# EAGLE design PickupBoard (EAGLE 7.2.0)
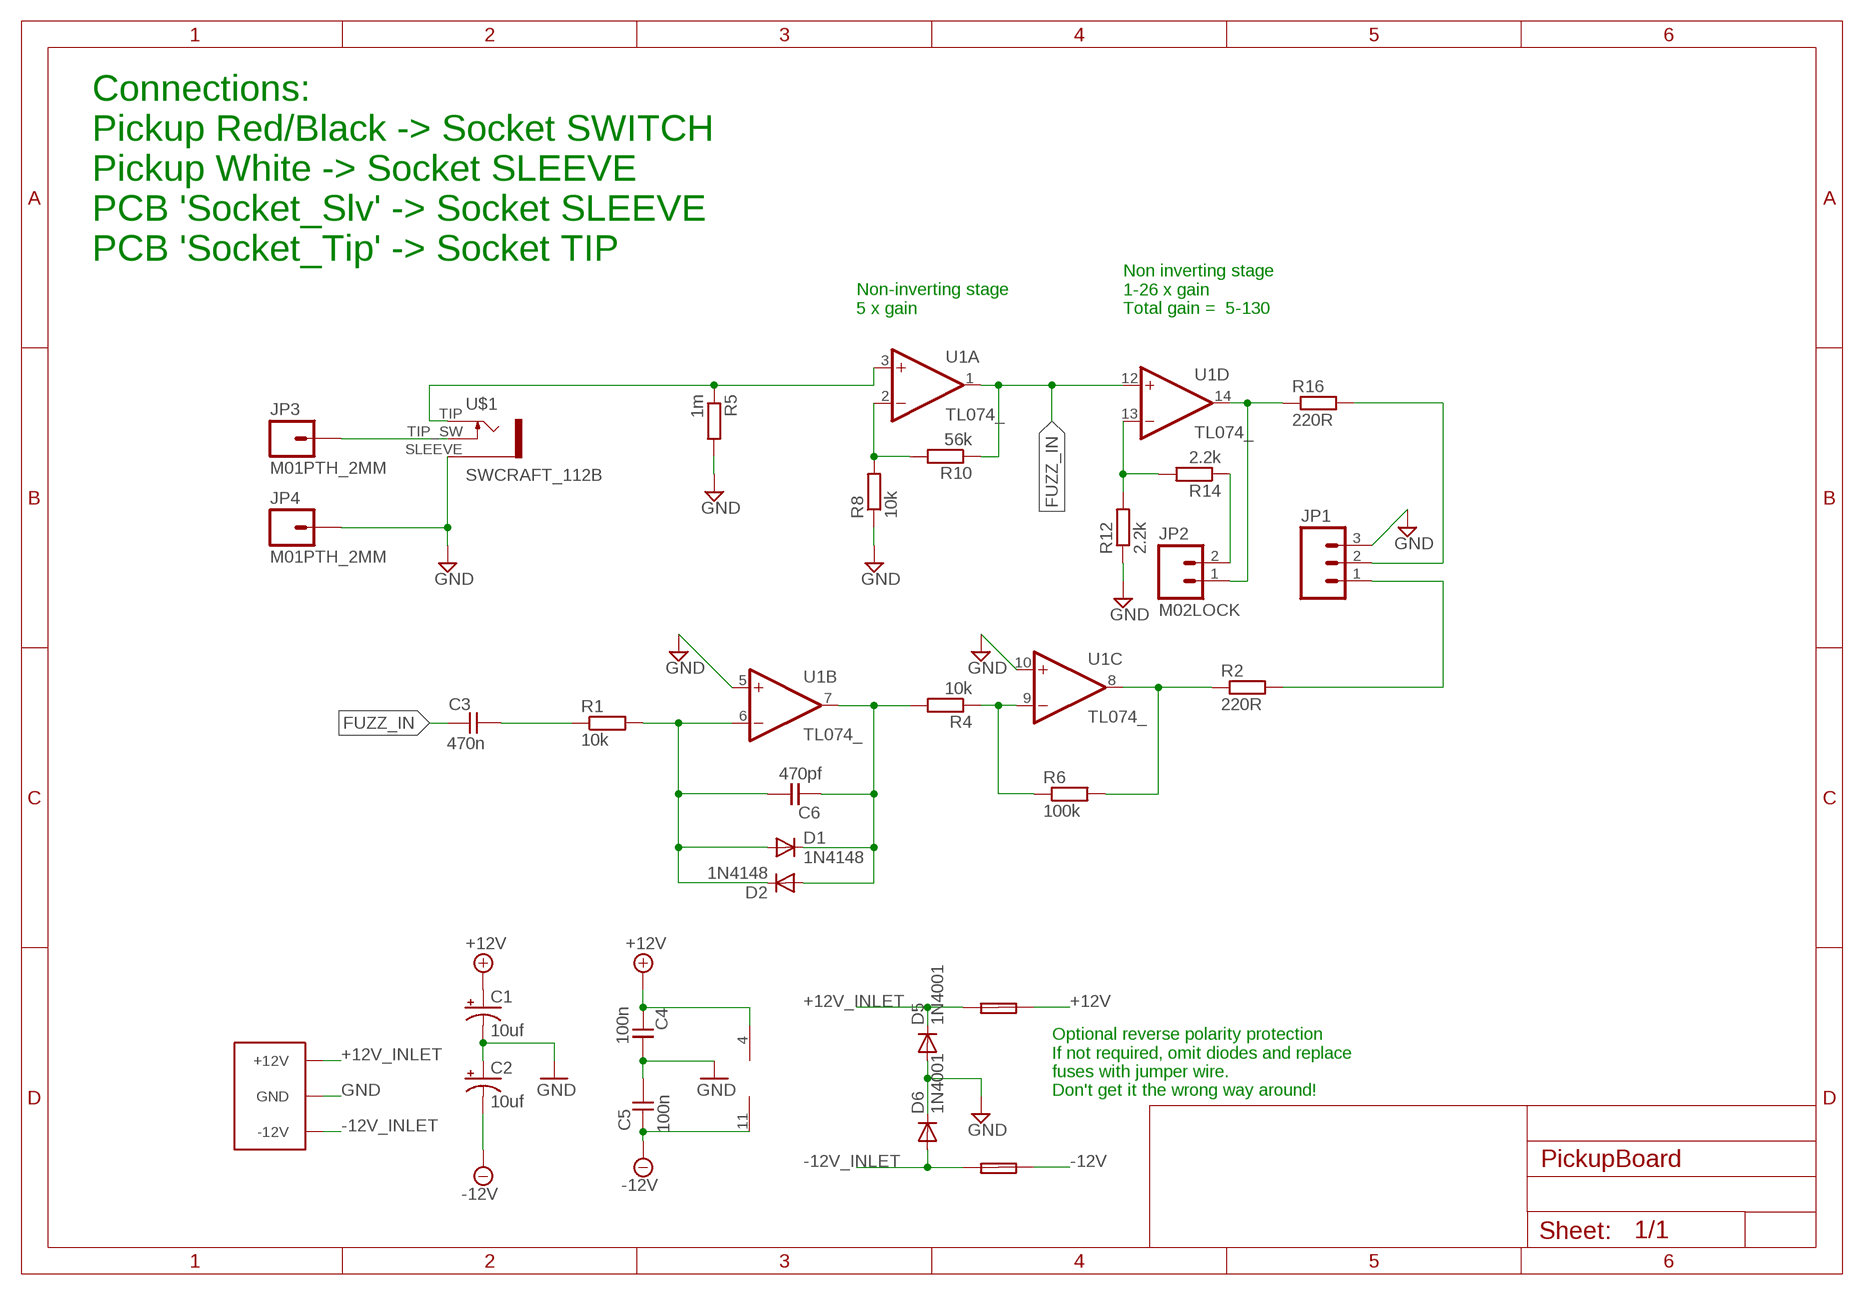
[diagram p0: schematic, sheet 1]

## Parts
1  FUSE  PTC_FUSEPOLY_FUSE  [C050H075X075]
C1  10uf  CAP_POLPTH2  [CPOL-RADIAL-10UF-25V]
C2  10uf  CAP_POLPTH2  [CPOL-RADIAL-10UF-25V]
C3  470n  C-EU050-024X044  [C050-024X044]
C4  100n  C-EU050-024X044  [C050-024X044]
C5  100n  C-EU050-024X044  [C050-024X044]
C6  470pf  C-EU050-024X044  [C050-024X044]
D1  1N4148  SMALL_DIODEDO35-7  [DO35-7]
D2  1N4148  SMALL_DIODEDO35-7  [DO35-7]
D5  1N4001  1N4004  [DO41-10]
D6  1N4001  1N4004  [DO41-10]
FUSE  FUSE  PTC_FUSEPOLY_FUSE  [C050H075X075]
JP1  M03LOCK  [1X03_LOCK]
JP2  M02LOCK  [1X02_LOCK]
JP3  M01PTH_2MM  [1X01_2MM]
JP4  M01PTH_2MM  [1X01_2MM]
R1  10k  RESISTOR7MM  [7MM_RESISTOR]
R2  220R  RESISTOR7MM  [7MM_RESISTOR]
R4  10k  RESISTOR7MM  [7MM_RESISTOR]
R5  1m  RESISTOR7MM  [7MM_RESISTOR]
R6  100k  RESISTOR7MM  [7MM_RESISTOR]
R8  10k  RESISTOR7MM  [7MM_RESISTOR]
R10  56k  RESISTOR7MM  [7MM_RESISTOR]
R12  2.2k  RESISTOR7MM  [7MM_RESISTOR]
R14  2.2k  RESISTOR7MM  [7MM_RESISTOR]
R16  220R  RESISTOR7MM  [7MM_RESISTOR]
U1  TL074_  [DIL14]
U$1  SWCRAFT_112B  [SWCRAFT_112_SLOTS]
U$2  EURO_POWER_LOCK  [EURO_PWR_HEADER_LOCK]

## Nets
+12V [power]: 1.2 C1.1(+) C4.2 U1.4(P:V+)
+12V_INLET: 1.1 D5.C U$2.POS1(+12V) U$2.POS2(+12V)
-12V [power]: C2.2(-) C5.2 FUSE.2 U1.11(P:V-)
-12V_INLET: D6.A FUSE.1 U$2.NEG1(-12V) U$2.NEG2(-12V)
FUZZ_IN: C3.2 R10.1 U1.1(A:OUT) U1.12(D:+IN)
GND [ground]: C1.2(-) C2.1(+) C4.1 C5.1 D5.A D6.C JP1.3 JP4.1 R5.2 R8.1 R12.1 U1.5(B:+IN) U1.10(C:+IN) U$1.SLEEVE U$2.GND1(GND) U$2.GND2(GND) U$2.GND3(GND) U$2.GND4(GND) U$2.GND5(GND) U$2.GND6(GND)
N$1: R5.1 U1.3(A:+IN) U$1.TIP
N$2: C6.2 D1.C D2.A R4.2 U1.7(B:OUT)
N$3: R8.2 R10.2 U1.2(A:-IN)
N$4: C6.1 D1.A D2.C R1.2 U1.6(B:-IN)
N$5: JP2.2 R14.1
N$6: R12.2 R14.2 U1.13(D:-IN)
N$7: C3.1 R1.1
N$8: JP2.1 R16.1 U1.14(D:OUT)
N$9: R4.1 R6.1 U1.9(C:-IN)
N$10: JP1.2 R16.2
N$11: R2.1 R6.2 U1.8(C:OUT)
N$13: JP1.1 R2.2
N$14: JP3.1 U$1.TIP_SW

## Notes on the sheet
- Connections:
  Pickup Red/Black -> Socket SWITCH
  Pickup White -> Socket SLEEVE
  PCB 'Socket_Slv' -> Socket SLEEVE
  PCB 'Socket_Tip' -> Socket TIP
- Non-inverting stage
  5 x gain
- Non inverting stage
  1-26 x gain
  Total gain =  5-130
- Optional reverse polarity protection
  If not required, omit diodes and replace
  fuses with jumper wire. 
  Don't get it the wrong way around!

## Library data of the parts
1 FUSE = TomW:PTC_FUSE
C1 C2 = SparkFun-Passives:CAP_POL: Capacitor Polarized These are standard SMD and PTH capacitors. Normally 10uF, 47uF, and 100uF in electrolytic and tantalum varieties. Always verify the external diameter of the through hole cap, it varies with capacity, voltage, and manufacturer. The EIA devices should be standard.
C3-C6 = TomW:C-EU: CAPACITOR, European symbol
D1 D2 = MusicThingModular:SMALL_DIODE: Small Signal Diode
D5 D6 = diode:1N4004: DIODE general purpose rectifier, 1 A
JP1 = SparkFun-Connectors:M03: Header 3 Standard 3-pin 0.1" header. Use with straight break away headers (SKU : PRT-00116), right angle break away headers (PRT-00553), swiss pins (PRT-00743), machine pins (PRT-00117), and female headers (PRT-00115). Molex polarized connector foot print use with SKU : PRT-08232 with associated crimp pins and housings.
JP2 = SparkFun-Connectors:M02: Standard 2-pin 0.1" header. Use with - straight break away headers ( PRT-00116) - right angle break away headers (PRT-00553) - swiss pins (PRT-00743) - machine pins (PRT-00117) - female headers (PRT-00115) Molex polarized connector foot print use with: PRT-08233 with associated crimp pins and housings. 2.54_SCREWTERM for use with PRT-10571. 3.5mm Screw Terminal footprints for PRT-08084 5mm Screw Terminal footprints for use with PRT-08433
JP3 JP4 = SparkFun-Connectors:M01: Header 1 Standard 1-pin 0.1" header. Use with straight break away headers (SKU : PRT-00116), right angle break away headers (PRT-00553), swiss pins (PRT-00743), machine pins (PRT-00117), and female headers (PRT-00115).
R1 R2 R4-R6 R8 R10 R12 R14 R16 = MusicThingModular:RESISTOR: Standard resistor, various versions
U1 = MusicThingModular:TL074: Generic Quad Op Amp
U$1 = TomW:SWCRAFT_112B
U$2 = MusicThingModular:EURO_POWER_LOCK

## Net classes
0 default: width 0.203 mm
1 power: width 0.203 mm
2 ground: width 0.203 mm

## Board
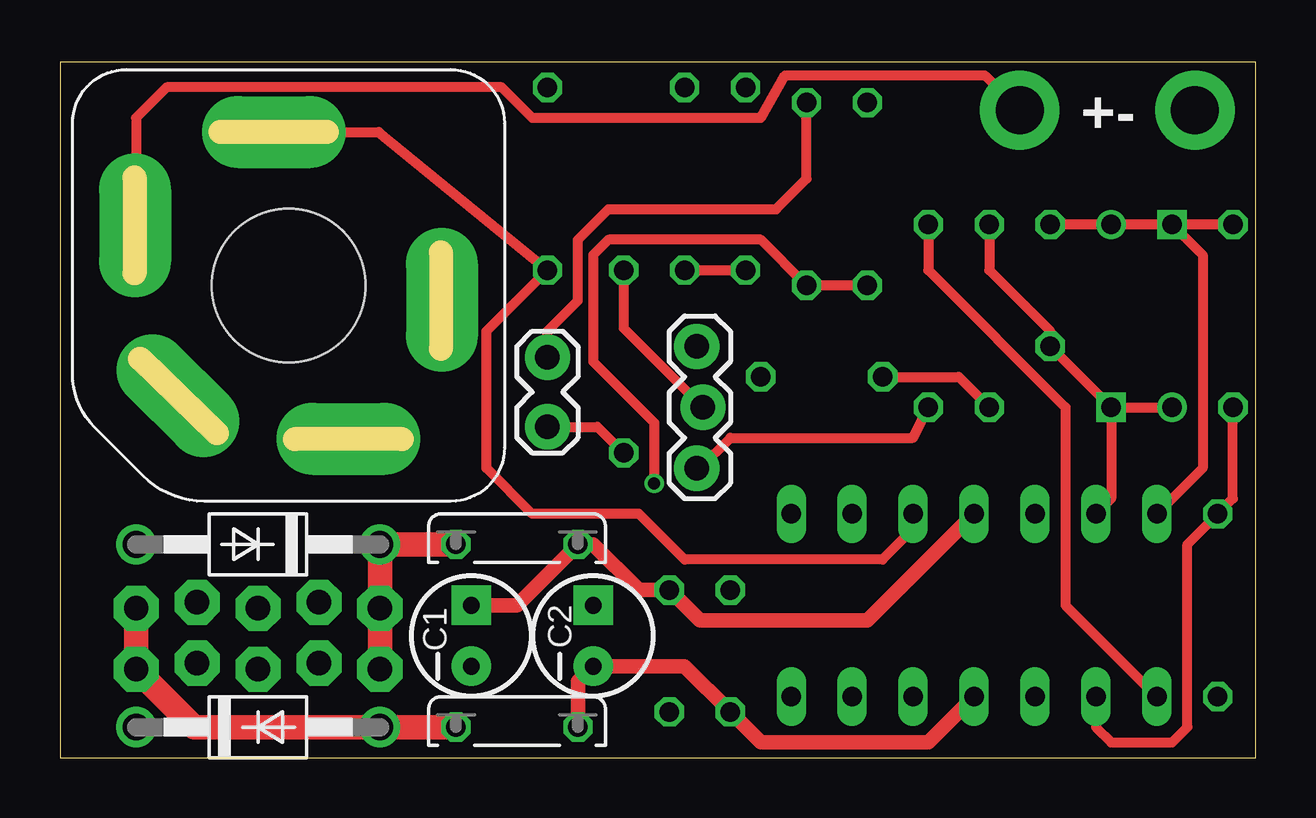
[diagram p1: board, top side]
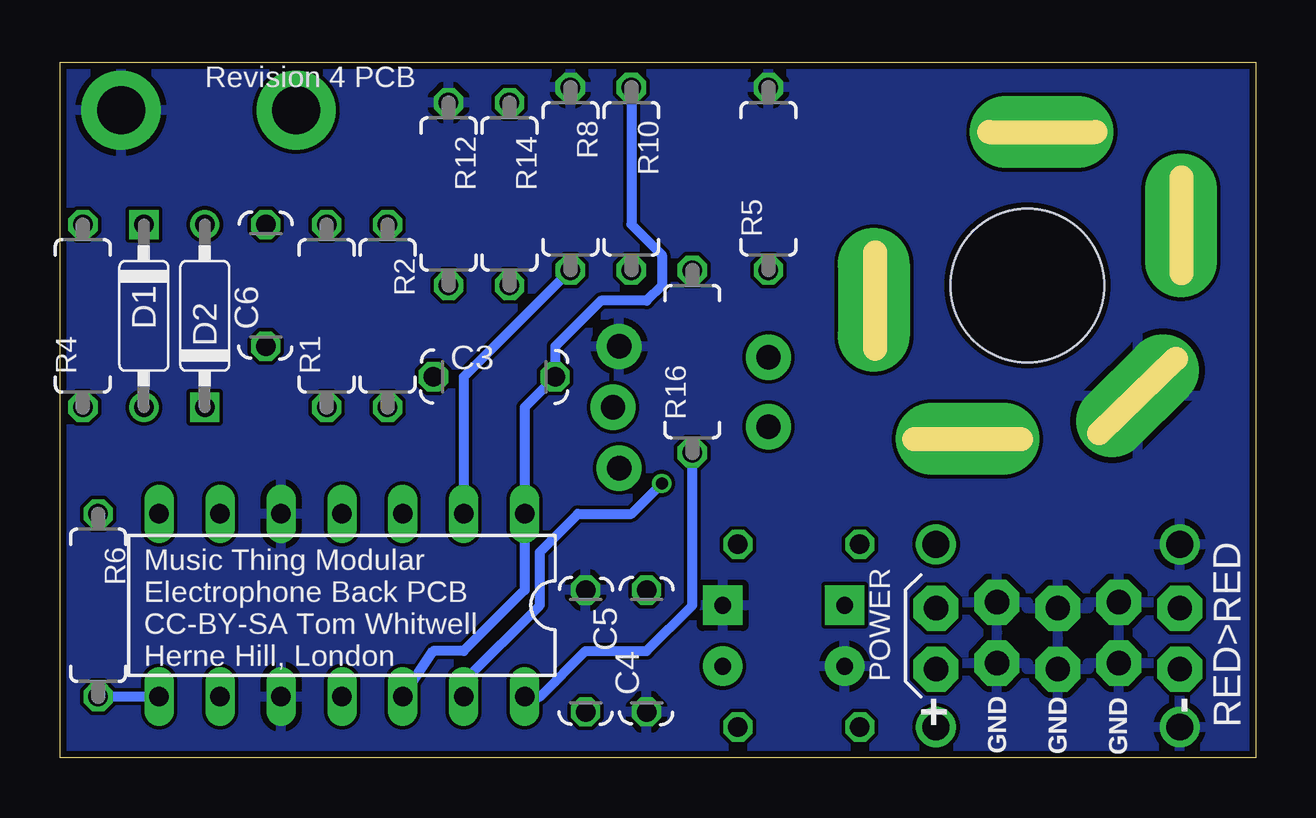
[diagram p2: board, bottom side, seen from below]

Size 49.85 x 29 mm. Coordinates in mm from the lower left corner, seen from the top.
Outline: 0,0 49.85,0 49.85,29 0,29 0,0
Copper layers (1*2*15*16): Top 0.035mm / dielectric 0.2mm / Route2 0.0175mm / dielectric 1.1mm / Route15 0.0175mm / dielectric 0.2mm / Bottom 0.035mm
Design rules "SeeedStudio_DRU_no_angle_20130527": minimum track width 6mil, minimum drill 12mil, track to track 6mil, track to pad 6mil, pad to pad 6mil, via to via 6mil, smd to smd 0mil, copper to edge 10mil, drill to drill 10mil, minimum pad ring 6mil, minimum via ring 6mil, stop-mask expansion 2mil, vias tented up to drill 25mil, thermal gap 10mil

### Footprints (pad centres in the part's own frame; a part is rotated, then mirrored left to right if it is on the bottom)
C050H075X075 = drill 0.813 octagon: 1 -2.54,0; 2 2.54,0
CPOL-RADIAL-10UF-25V = drill 0.7 pad 1.651 square: 1 1.27,0 | drill 0.7 pad 1.651: 2 -1.27,0
C050-024X044 = drill 0.813 octagon: 1 -2.54,0; 2 2.54,0
DO35-7 = drill 0.813: A 3.81,0 | drill 0.813 square: C -3.81,0
DO41-10 = drill 1.118: A 5.08,0; C -5.08,0
1X03_LOCK = drill 1.016 pad 1.88: 1 0,0.127; 2 2.54,-0.127; 3 5.08,0.127
1X02_LOCK = drill 1.016 pad 1.88: 1 -0.178,0; 2 2.718,0
1X01_2MM = drill 2 pad 3.302: 1 0,0
7MM_RESISTOR = drill 0.813 octagon: 1 -3.81,0; 2 3.81,0
DIL14 = drill 0.813 long: 1 -7.62,-3.81; 2 -5.08,-3.81; 3 -2.54,-3.81; 4 0,-3.81; 5 2.54,-3.81; 6 5.08,-3.81; 7 7.62,-3.81; 8 7.62,3.81; 9 5.08,3.81; 10 2.54,3.81; 11 0,3.81; 12 -2.54,3.81; 13 -5.08,3.81; 14 -7.62,3.81
SWCRAFT_112_SLOTS = drill 0.45 pad 3 long: RING 0.6,6.4; RING_SW 6.4,2.5; SLEEVE 4.6,-4.6; TIP -6.4,-0.6; TIP_SW -2.5,-6.4 | hole 6.4: 0,0
EURO_PWR_HEADER_LOCK = drill 1.016 pad 1.88 octagon: GND1 -2.54,1.143; GND2 -2.54,-1.397; GND3 0,1.397; GND4 0,-1.143; GND5 2.54,1.143; GND6 2.54,-1.397; NEG1 -5.08,1.397; NEG2 -5.08,-1.143; POS1 5.08,1.397; POS2 5.08,-1.143

### Placement (x,y rotation side)
1  19.05,8.89 0 top
C1  17.14,5.08 90 top
C2  22.23,5.08 90 top
C3  31.75,15.88 0 bottom
C4  25.4,4.45 90 bottom
C5  27.94,4.45 270 bottom
C6  41.27,19.68 90 bottom
D1  46.35,18.41 270 bottom
D2  43.81,18.41 90 bottom
D5  8.26,8.89 180 top
D6  8.26,1.27 0 top
FUSE  19.05,1.27 0 top
JP1  26.67,12.06 90 top
JP2  20.32,13.97 90 top
JP3  40.01,26.99 0 bottom
JP4  47.31,26.99 0 bottom
R1  38.73,18.41 90 bottom
R2  36.2,18.41 270 bottom
R4  48.9,18.41 90 bottom
R5  20.32,24.13 90 bottom
R6  48.26,6.35 270 bottom
R8  28.57,24.13 270 bottom
R10  26.04,24.13 270 bottom
R12  33.66,23.5 270 bottom
R14  31.11,23.5 270 bottom
R16  23.5,16.51 90 bottom
U1  38.1,6.35 180 bottom
U$1  9.53,19.68 270 top
U$2  8.26,5.08 180 bottom

### Tracks (layer width: path | path; a pad name or v marks a point on that pad's centre or on a via)
+12V
  Top 0.61: C1.1 19.05,6.35 1.2 22.23,8.89 24.13,6.99 C4.2 26.67,5.71 33.66,5.71 U1.4
+12V_INLET
  Top 1.016: U$2.POS1 U$2.POS2 D5.C 1.1
-12V
  Top 0.61: FUSE.2 21.59,3.17 C2.2 26.04,3.81 C5.2 29.21,0.64 31.11,0.64 36.2,0.64 U1.11
-12V_INLET
  Top 1.016: FUSE.1 D6.A 5.59,1.27 U$2.NEG1 U$2.NEG2
FUZZ_IN
  Bottom 0.406: U1.12 34.29,4.45 33.02,4.45 30.48,6.99 U1.1 30.48,14.61 C3.2 29.21,17.14 27.3,19.05 25.4,19.05 24.77,19.68 24.77,20.95 26.04,22.23 R10.1
GND
  pour Bottom: 0,29.53 0,0 50.27,0 50.27,29.53
N$1
  Top 0.406: U$1.TIP 13.29,26.09 R5.1 17.78,17.78 17.78,12.06 19.68,10.16 24.13,10.16 26.04,8.26 34.29,8.26 35.56,9.53 U1.3
N$2
  Top 0.406: R4.2 D1.C | D1.C D2.A C6.2 | D1.C 47.62,20.95 47.62,12.06 U1.7
N$3
  Top 0.406: R10.2 R8.2
  Bottom 0.406: R8.2 33.02,15.88 U1.2
N$4
  Top 0.406: D2.C D1.A | R1.2 38.73,20.32 41.27,17.78 C6.1 D2.C | D2.C 43.81,10.79 U1.6
N$5
  Top 0.406: JP2.2 20.32,17.78 21.59,19.05 21.59,21.59 22.86,22.86 29.84,22.86 31.11,24.13 R14.1
N$6  (via drill 0.5)
  Top 0.406: R12.2 R14.2 29.21,21.59 22.86,21.59 22.23,20.95 22.23,16.51 24.77,13.97 v24.77,11.43
  Bottom 0.406: U1.13 33.02,3.17 29.84,6.35 29.84,8.57 28.26,10.16 26.04,10.16 v24.77,11.43
N$7
  Top 0.406: C3.1 37.47,15.88 R1.1
N$8
  Top 0.406: JP2.1 22.4,13.79 R16.1
  Bottom 0.406: U1.14 29.84,2.54 27.94,4.45 25.4,4.45 23.5,6.35 R16.1
N$9
  Top 0.406: U1.9 43.18,1.27 43.81,0.64 46.35,0.64 46.99,1.27 46.99,8.89 R6.1 48.9,10.79 R4.1
N$10
  Top 0.406: R16.2 23.5,17.91 JP1.2
N$11
  Top 0.406: R2.1 36.2,20.32 41.91,14.61 41.91,6.35 U1.8
  Bottom 0.406: U1.8 R6.2
N$13
  Top 0.406: JP1.1 26.67,12.06 27.94,13.34 35.56,13.34 R2.2
N$14
  Top 0.406: U$1.TIP_SW 3.17,22.23 3.17,26.67 4.45,27.94 18.41,27.94 19.68,26.67 29.21,26.67 30.23,28.45 38.54,28.45 JP3.1

### Text on the board
tPlace: +-
bPlace: Revision 4 PCB | Music Thing Modular / Electrophone Back PCB / CC-BY-SA Tom Whitwell / Herne Hill, London